# Altium project BBConverter.PrjPcb
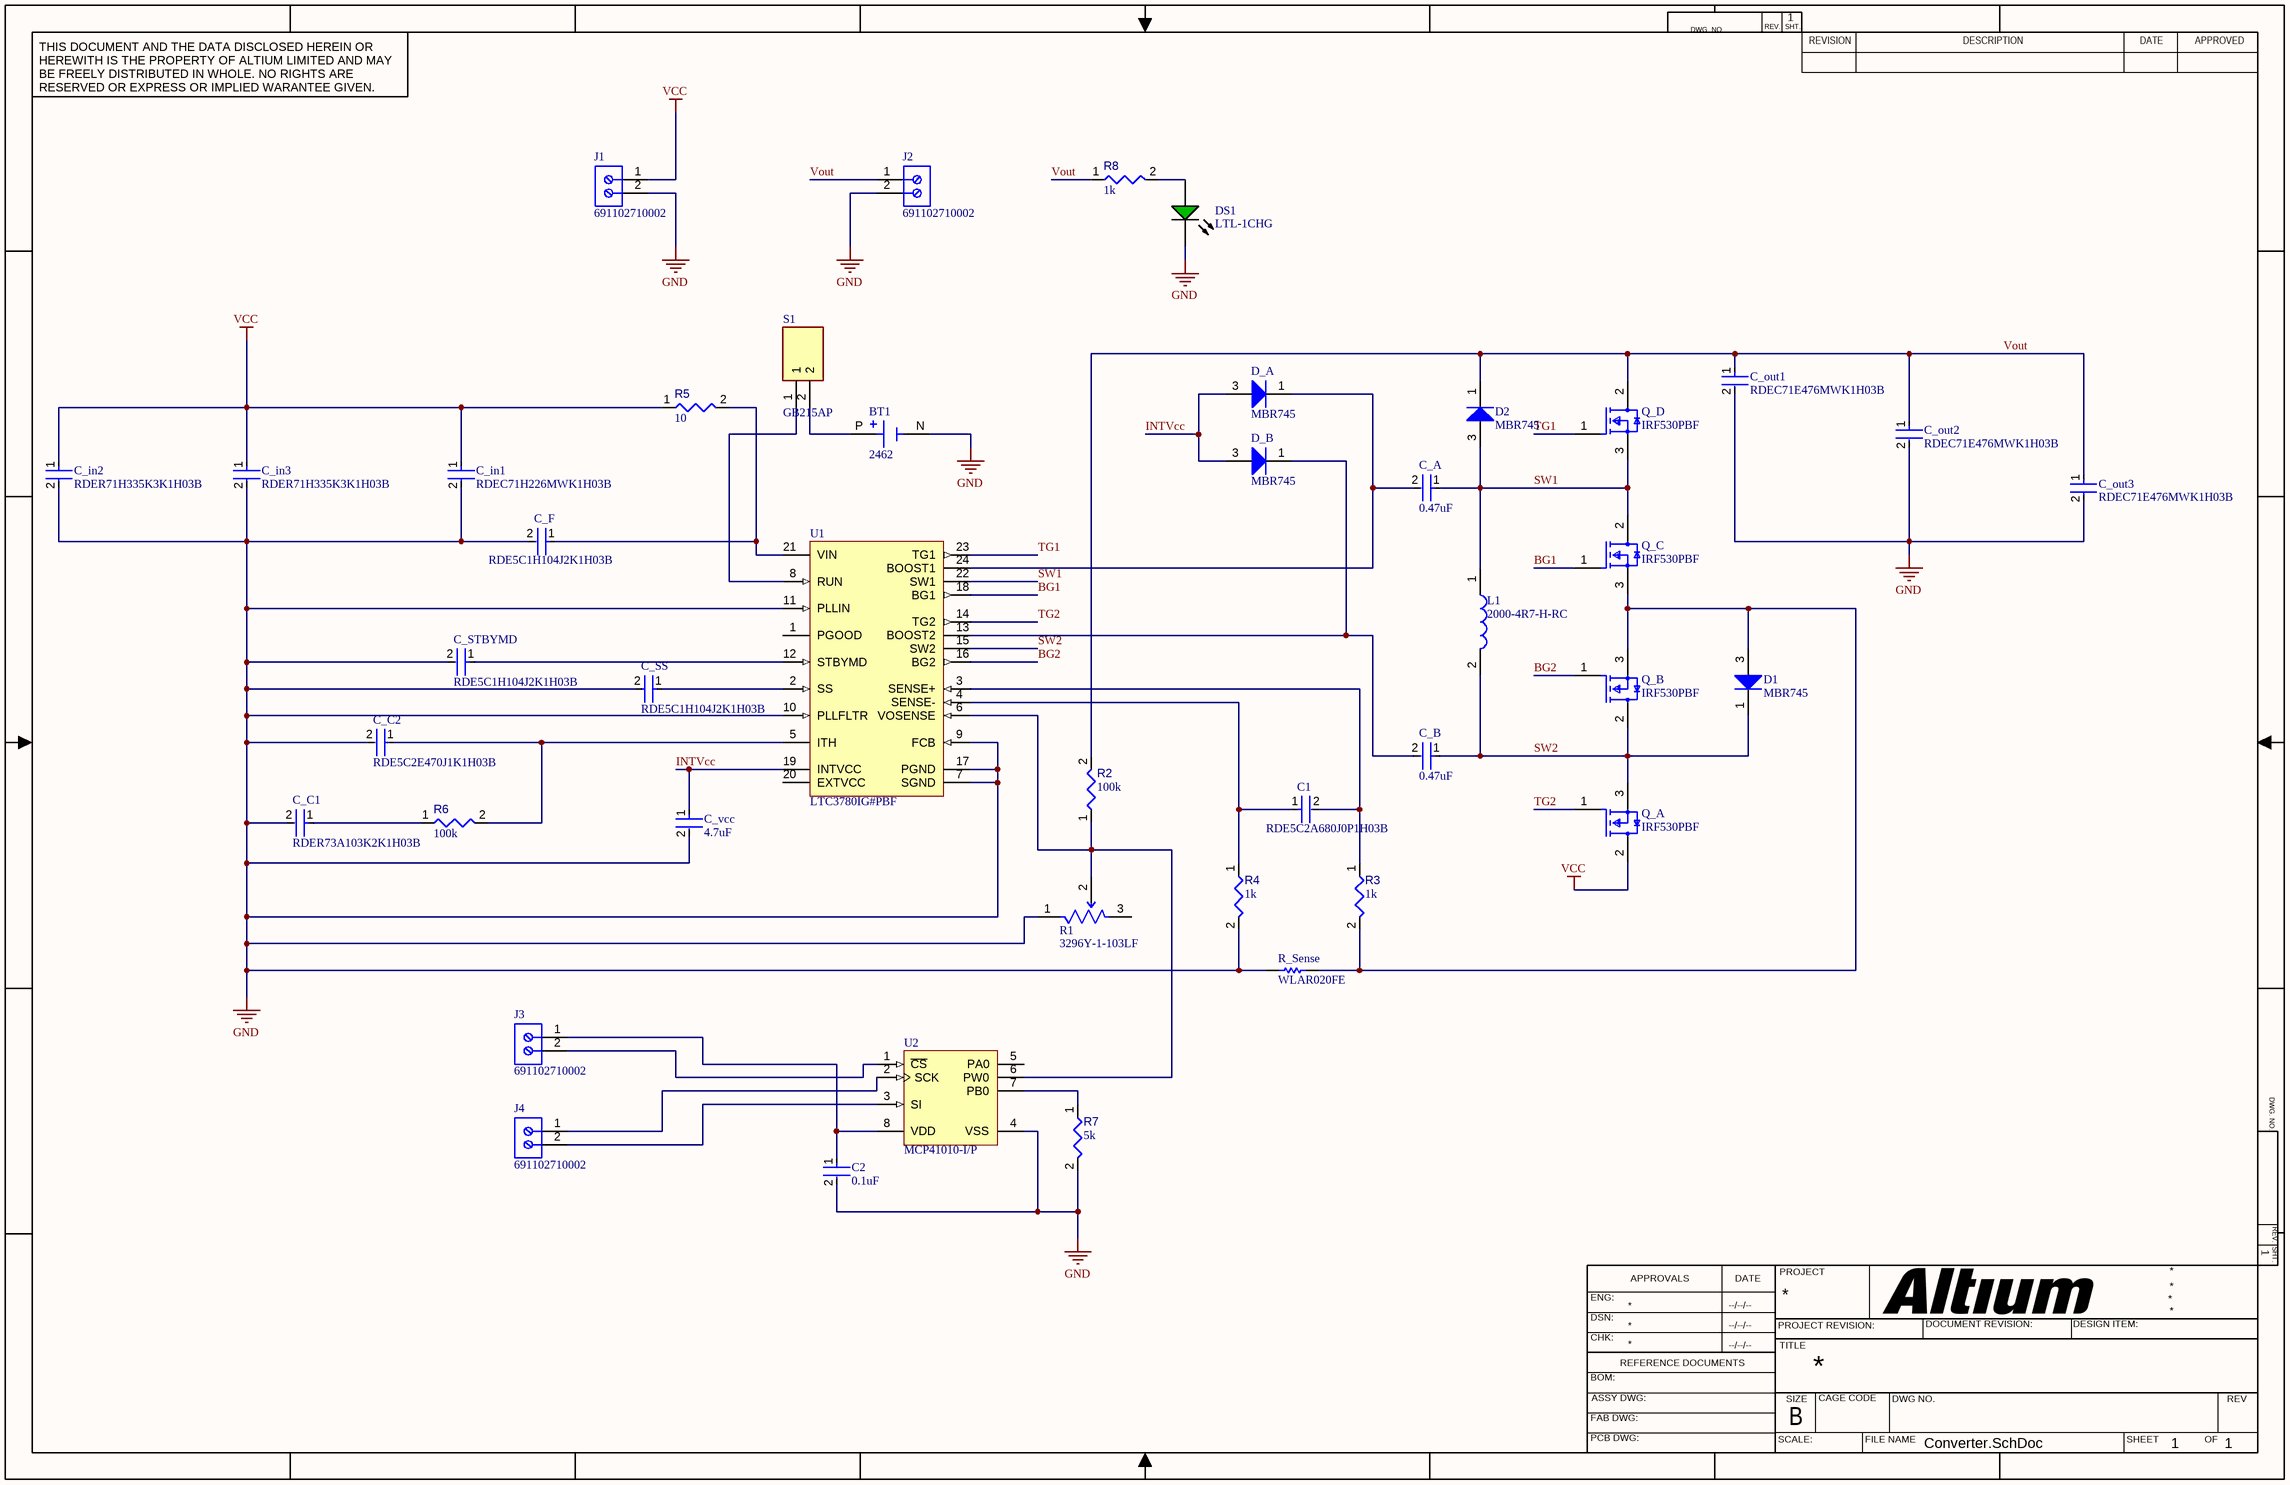
[diagram p0:  Converter.SchDoc]
 CAGE_CODE: ?????;  CONTRACT_NUMBER: <CONTRACT NO>;  DOC_NO_ASSY_DWG: <ASSY DWG NO>;  DOC_NO_BOM: <BOM DOC NO>;  DOC_NO_FAB_DWG: <FAB DWG NO>;  DOC_NO_SCH_DWG: <SCH DWG NO>;  PCB_2_DEC_TOL: +/-.01;  PCB_3_DEC_TOL: +/-.010;  PCB_ANG_TOL: +/-1/2;  PCB_ASSEMBLY_NO: <PCB ASSY NO>;  PCB_CHECKER: - -----;  PCB_CHECKER_APP_DATE: --/--/----;  PCB_DESIGNER: - -----;  PCB_DESIGNER_APP_DATE: --/--/----;  PCB_DWG_NO: <PCB DWG NO>;  PCB_ENGINEER: - -----;  PCB_ENGINEER_APP_DATE: --/--/----;  PCB_PART_NUMBER: <PCB PN>;  PCB_REV: A;  SCH_REV: A
1 sheet, 43 parts. Net scope: global (net labels, ports and power ports of the same name join across sheets).
Board file:  Converter.PcbDoc

## Sheet  Converter.SchDoc
size 431 x 279 mm; SheetNumber: 1; SheetTotal: 1; ENG_APP_DATE: --/--/--; DSN_APP_DATE: --/--/--; CHK_APP_DATE: --/--/--

### Parts
BT1  2462  [BAT_2462]
C1  RDE5C2A680J0P1H03B  [FP-RDE0P1-MFG]
C2  0.1uF  [FP-RDE2M1-MFG]
C_A  0.47uF  [FP-RCE1A2-MFG]
C_B  0.47uF  [FP-RCE1A2-MFG]
C_C1  RDER73A103K2K1H03B  [FP-RDE2M1-MFG]
C_C2  RDE5C2E470J1K1H03B  [FP-RDE1K1-MFG]
C_F  RDE5C1H104J2K1H03B  [FP-RDE2M1-MFG]
C_in1  RDEC71H226MWK1H03B  [FP-RDEWK1-MFG]
C_in2  RDER71H335K3K1H03B  [FP-RDE3M1-MFG]
C_in3  RDER71H335K3K1H03B  [FP-RDE3M1-MFG]
C_out1  RDEC71E476MWK1H03B  [FP-RDEWK1-MFG]
C_out2  RDEC71E476MWK1H03B  [FP-RDEWK1-MFG]
C_out3  RDEC71E476MWK1H03B  [FP-RDEWK1-MFG]
C_SS  RDE5C1H104J2K1H03B  [FP-RDE2M1-MFG]
C_STBYMD  RDE5C1H104J2K1H03B  [FP-RDE2M1-MFG]
C_vcc  4.7uF  [FP-RDE2M1-MFG]
D1  MBR745  [ONSC-TO-220-2-221B-04_E]
D2  MBR745  [ONSC-TO-220-2-221B-04_E]
D_A  MBR745  [ONSC-TO-220-2-221B-04_E]
D_B  MBR745  [ONSC-TO-220-2-221B-04_E]
DS1  LTL-1CHG  [LTST-LTL-1CHG-2]
J1  691102710002  [691102710002]
J2  691102710002  [691102710002]
J3  691102710002  [691102710002]
J4  691102710002  [691102710002]
L1  2000-4R7-H-RC  [20004R7HRC]
Q_A  IRF530PBF  [FP-X15-0364-MFG]
Q_B  IRF530PBF  [FP-X15-0364-MFG]
Q_C  IRF530PBF  [FP-X15-0364-MFG]
Q_D  IRF530PBF  [FP-X15-0364-MFG]
R1  3296Y-1-103LF  [FP-3296Y-MFG]
R2  value 100k  [RESA60-630X240]  (hidden comment: MFR-25FBF52-1K)
R3  value 1k  [RESA60-630X240]  (hidden comment: MFR-25FBF52-1K)
R4  value 1k  [RESA60-630X240]  (hidden comment: MFR-25FBF52-1K)
R5  value 10  [RESA60-630X240]  (hidden comment: MFR-25FBF52-1K)
R6  value 100k  [RESA60-630X240]  (hidden comment: MFR-25FBF52-1K)
R7  value 5k  [RESA60-630X240]  (hidden comment: MFR-25FBF52-1K)
R8  value 1k  [RESA60-630X240]  (hidden comment: MFR-25FBF52-1K)
R_Sense  WLAR020FE  [OMTE-WLA-2_V2]
S1  GB215AP  [GB215AP]
U1  LTC3780IG#PBF  [LT-G-24_M]
U2  MCP41010-I/P  [PDIP300-P8]

### Nets
GND: BT1.N(NEG) C2.2 C_C1.2 C_C2.2 C_F.2 C_in1.2 C_in2.2 C_in3.2 C_out1.2 C_out2.2 C_out3.2 C_SS.2 C_STBYMD.2 C_vcc.2 DS1.2(K) J1.2 J2.2 R1.1(CCW) R4.2 R7.2 R_Sense.1 U1.7(SGND) U1.9(FCB) U1.10(PLLFLTR) U1.11(PLLIN) U1.17(PGND) U2.4(VSS)
VCC: C_in1.1 C_in2.1 C_in3.1 J1.1 Q_A.2(D) R5.1
BG1: Q_C.1(G) U1.18(BG1)
BG2: Q_B.1(G) U1.16(BG2)
INTVcc: C_vcc.1 D_A.3(A) D_B.3(A) U1.19(INTVCC)
SW1: C_A.1 D2.3(A) L1.1 Q_C.2(D) Q_D.3(S) U1.22(SW1)
SW2: C_B.1 D1.1(K) L1.2 Q_A.3(S) Q_B.2(D) U1.15(SW2)
TG1: Q_D.1(G) U1.23(TG1)
TG2: Q_A.1(G) U1.14(TG2)
Vout: C_out1.1 C_out2.1 C_out3.1 D2.1(K) J2.1 Q_D.2(D) R2.2 R8.1
NetBT1_P: BT1.P(POS) S1.2
NetC1_1: C1.1 R4.1 U1.4(SENSE-)
NetC1_2: C1.2 R3.1 U1.3(SENSE+)
NetC2_1: C2.1 J3.1 U2.8(VDD)
NetC_A_2: C_A.2 D_A.1(K) U1.24(BOOST1)
NetC_B_2: C_B.2 D_B.1(K) U1.13(BOOST2)
NetC_C1_1: C_C1.1 R6.1
NetC_C2_1: C_C2.1 R6.2 U1.5(ITH)
NetC_F_1: C_F.1 R5.2 U1.21(VIN)
NetC_SS_1: C_SS.1 U1.2(SS)
NetC_STBYMD_1: C_STBYMD.1 U1.12(STBYMD)
NetD1_3: D1.3(A) Q_B.3(S) Q_C.3(S) R3.2 R_Sense.2
NetDS1_1: DS1.1(A) R8.2
NetJ3_2: J3.2 U2.1(~{CS})
NetJ4_1: J4.1 U2.2(SCK)
NetJ4_2: J4.2 U2.3(SI)
NetR1_2: R1.2(WIPER) R2.1 U1.6(VOSENSE) U2.6(PW0)
NetR7_1: R7.1 U2.7(PB0)
NetS1_1: S1.1 U1.8(RUN)

Not connected (* = marked no-connect by the designer): R1 3(CW); U1 1(PGOOD) 20(EXTVCC); U2 5(PA0)

### Notes on the sheet
- DWG. NO.
- REV.
- SHT.
- THIS DOCUMENT AND THE DATA DISCLOSED HEREIN OR HEREWITH IS THE PROPERTY OF ALTIUM LIMITED AND MAY BE FREELY DISTRIBUTED IN WHOLE. NO RIGHTS ARE RESERVED OR EXPRESS OR IMPLIED WARANTEE GIVEN.
- REVISION
- DESCRIPTION
- DATE
- APPROVED
- ENG:
- APPROVALS
- PROJECT
- DSN:
- CHK:
- REFERENCE DOCUMENTS
- PROJECT REVISION:
- TITLE
- DOCUMENT REVISION:
- DESIGN ITEM:
- BOM:
- FAB DWG:
- PCB DWG:
- ASSY DWG:
- SCALE:
- SIZE
- B
- CAGE CODE
- FILE NAME
- DWG NO.
- SHEET
- OF
- REV

### Library data of the parts
BT1 = 2462: Battery Holder (Open) AA 2 Cell PC Pin; MF: {'manufacturer': u'Keystone'}; MP: 2462; Availability: Unavailable; Package: None; Value: *; Price: None
C1 = CMP-06035-029057-1: Ceramic Capacitor 68pF ±5% 100V C0G Radial; Lead Diameter: 0.5mm; Dielectric: C0G; Width: 3.5mm; Min Operating Temperature: -55°C; Length: 0.197inch; Case/Package: Radial; Voltage Rating (DC): 100V; Packaging: Bulk; Package Quantity: 500; Lead Pitch: 0.098inch; Max Operating Temperature: 125°C; Height: 3.5mm; Capacitance: 68pF; Tolerance: 5%; Resistor Type: Ceramic; Voltage Rating: 100V; Height - Seated (Max): 0.236inch; Mount: Through Hole; Termination: Radial
C2 C_vcc = CMP-06035-049833-1: Ceramic Capacitor 4.7uF ±10% 50V X7S Radial; Lead Diameter: 0.5mm; Lead/Base Style: Kinked; Lead Pitch: 0.197inch; Height - Seated (Max): 0.236inch; Dielectric: X7S; Case/Package: Radial; Voltage Rating: 50V; Min Operating Temperature: -55°C; Voltage Rating (DC): 50V; Max Operating Temperature: 125°C; Length: 0.217inch; Capacitance: 4.7uF; Tolerance: 10%; Package Quantity: 1500; Packaging: Tape and Reel; Width: 0.124inch; Termination: Radial; Resistor Type: Ceramic; Mount: Through Hole; Height: 4mm
C_A C_B = CMP-06035-009921-1: Cap Ceramic 470nF 50V X7R ±10% Radial 2.5mm +125°C Automotive Bulk; Lead Diameter: 0.5mm; Lead/Base Style: Straight; Length: 0.157inch; Tolerance: 10%; Ratings: AEC-Q200; Case/Package: Radial; Termination: Radial; Resistor Type: Ceramic; Lead Pitch: 0.098inch; Min Operating Temperature: -55°C; Voltage Rating (DC): 50V; Width: 0.098inch; Height - Seated (Max): 0.138inch; Height: 3.5mm; Voltage Rating: 50V; Capacitance: 470nF; Packaging: Bulk; Mount: Through Hole; Max Operating Temperature: 125°C; Dielectric: X7R; Package Quantity: 500
C_C1 = CMP-06035-036813-1: Ceramic Capacitor 10nF ±10% 1kV X7R Radial; Lead/Base Style: Formed Leads; Capacitance: 10nF; Mount: Through Hole; Packaging: Bulk; Max Operating Temperature: 125°C; Tolerance: 10%; Voltage Rating: 1kV; Min Operating Temperature: -55°C; Case/Package: Radial
C_C2 = CMP-06035-055819-1: Ceramic Capacitor 47pF ±5% 250V C0G Radial
C_F C_SS C_STBYMD = CMP-06035-058915-1: Ceramic Capacitor 100nF ±5% 50V C0G Radial
C_in1 = CMP-06035-003638-1: CAP CER 22UF 50V X7S RADIAL; Lead/Base Style: Formed Leads; Tolerance: 20%; Mount: Through Hole; Max Operating Temperature: 125°C; Capacitance: 22uF; Packaging: Bulk; Voltage Rating: 50V; Min Operating Temperature: -55°C; Case/Package: Radial
C_in2 C_in3 = CMP-06035-014114-1: Ceramic Capacitor 3.3uF ±10% 50V X7R Radial; Lead/Base Style: Kinked; Lead Diameter: 0.5mm; Dielectric: X7R; Capacitance: 3.3uF; Lead Free: Lead Free; Voltage Rating: 50V; Packaging: Bulk; Termination: Radial; Resistor Type: Ceramic; Height: 5mm; Min Operating Temperature: -55°C; Length: 0.217inch; Tolerance: 10%; Case/Package: Radial; Max Operating Temperature: 125°C; Width: 0.157inch; Voltage Rating (DC): 50V; Height - Seated (Max): 0.295inch; Package Quantity: 500; Mount: Through Hole; Lead Pitch: 0.197inch
C_out1-C_out3 = CMP-06035-015598-1: Ceramic Capacitor 47uF ±20% 25V X7S Radial; Lead/Base Style: Formed Leads; Lead Diameter: 0.5mm; Mount: Through Hole; Lead Pitch: 0.197inch; Packaging: Bulk; Max Operating Temperature: 125°C; Package Quantity: 500; Lead Free: Lead Free; Length: 0.217inch; Termination: Radial; Tolerance: 20%; Capacitance: 47uF; Voltage Rating (DC): 25V; Width: 0.157inch; Voltage Rating: 25V; Resistor Type: Ceramic; Dielectric: X7S; Height - Seated (Max): 0.394inch; Case/Package: Radial; Min Operating Temperature: -55°C; Height: 7.5mm
D1 D2 D_A D_B = CMP-1055-00594-1: SWITCHMODE(TM) Power Rectifier, 2-Pin TO-220, Tube; Manufacturer: On Semiconductor; IFSM Max (A): 150; Configuration: Single; Mounting Technology: Through Hole; PackageVersion: Rev. E; ComponentLink3URL: http://www.onsemi.com/pub_link/Collateral/BYW29-D.PDF; PackageDescription: 2-Pin Flange Mount, Vertical Straight Lead, Body 9.97 x 4.44 mm, Pitch 5.08 mm; Packing: Tube; ComponentLink3Description: Package Specification; ComponentLink2Description: Datasheet; ComponentLink1URL: http://www.onsemi.com/; ComponentLink2URL: http://www.onsemi.cn/pub_link/Collateral/MBR735-D.PDF; RoHS: FALSE; ComponentLink1Description: Manufacturer URL; PackageReference: TO-220-2-221B-04_E; DatasheetVersion: Rev. 8; PartNumber: MBR745
DS1 = CMP-007-00019-2: LED Uni-Color Green, 100 mW, 30 mA, -55 to 100 degC, 2-Pin THD, RoHS, Bulk; Manufacturer: Lite-On; Power: 100mW; Forward Voltage: 2.6V; Forward Current: 30mA; Nominal Vf: 2.1V; Lens Style: Dome; Viewing Angle: 60degrees; Luminous Intensity: 12.6mcd; Max Operating Temperature: 100°C; Case/Package: Radial; Package Reference: LTL-1CHG; Manufacturer URL: http://www.us.liteon.com/; Package Quantity: 1000; Colour: Green; Packaging: Bulk; RoHS Compliant: True; Datasheet URL: http://datasheet.octopart.com/LTL-1CHG-Lite-On-datasheet-143841.pdf; Package Description: 2-Pin Through Hole Device, Dia 3.8 mm; Min Operating Temperature: -55°C; Mounting Technology: TH; Pins: 2; Illumination Colour: Green; Datasheet Version: Mar-00
J1-J4 = CMP-1502-03258-1: Series 102 - 5.00 mm Horizontal Entry Modular with Pressure Clamp WR-TBL, 2 pin; Manufacturer: Wurth Elektronik; Pin Number: 2; Pitch: 5.00mm; Manufacturer URL: http://www.we-online.de; Mounting Technology: THT; Publisher: WurthElektronik; Packaging: Box; Package Reference: 691102710002; Datasheet URL: http://katalog.we-online.de/em/datasheet/6911027100xx.pdf; Operating Temperature: -40to105degC; Part Number: 691102710002
L1 = 2000-4R7-H-RC: Inductor; Manufacturer_Name: Bourns; Datasheet Link: https://componentsearchengine.com/Datasheets/1/2000-4R7-H-RC.pdf; Height: 10.414mm; Manufacturer_Part_Number: 2000-4R7-H-RC
Q_A Q_B Q_C Q_D = CMP-02550-000190-1: MOSFET N-CH 100V 14A TO-220AB; Manufacturer: Vishay; Reverse Recovery Charge: 850nC; Rthja Max: 62°C/W; Power Dissipation: 88W; Depletion Mode: False; Input Capacitace At Vds: 670pF @ 25V; Pulse Drain Current: 56A; Turn On Delay Time: 10ns; Drain To Source Resistance: 0.16Ω; Number Of N Channels: 1; Max Junction Temp: +175°C; Threshold Vgs Max: 4V; Standoff Height: 3.33mm; Max Forward Diode Voltage: 2.5V; Turn Off Delay Time: 23ns; Gate To Source Voltage: 20V; Threshold Vgs Min: 2V; Reverse Recovery Time: 150ns; Gate Charge At Vgs: 26nC @ 10V; Temperature: -55°C to +175°C; Drain To Source Voltage: 100V; Mouser Description: MOSFET N-Chan 100V 14 Amp; Device Class L2: Transistors; Temperature Range High: +175°C; ComponentLink2URL: http://www.vishay.com/docs/91019/91019.pdf; Lead Free: Yes; Height: 19.89mm; Octopart: https://octopart.com/irf530pbf-vishay-46547999; Category: Trans; ComponentLink2Description: Datasheet; RoHS: TRUE; Device Class L3: MOSFETs; Automotive: No; Device Class L1: Discrete Semiconductors; Package: X15-0364; Manufacturer Part Number: IRF530PBF; Continuous Drain Current: 14A; Digikey Description: MOSFET N-CH 100V 14A TO-220AB; Number Of Channels: 1; Drain To Source Breakdown Voltage: 100V; Temperature Range Low: -55°C
R1 = CMP-07234-000015-2: TRIMMER 10K OHM 0.5W PC PIN TOP; Manufacturer Series: 3296; Resistance: 10kR; Actuator Orientation: Vertical; Power Rating: 500mW; Temperature Coefficient: 100ppm/°C; Resistance Tolerance: 10%; Resistance Law: Linear; Number of Turns: 25; Actuator Type: SCREW; Number of Terminals/Pins: 3; Insulation Resistance: 1GR; Military Standard: Not; REACH SVHC: No SVHC; Lead Free: Lead Free; Resistor Type: Cermet; Max Operating Temperature: 125°C; Radiation Hardening: No; Package Quantity: 50; Mount: Panel; Max Power Dissipation: 500mW; Min Operating Temperature: -55°C; Type: Potentiometer; Terminal Finish: Tin; Termination: Pin; Taper: Linear; Color: Blue; Technology: CERMET; Packaging: Rail/Tube; Weight: 0.03oz; Height: 0.395inch; Number of Pins: 3; RoHS Compliant: Yes; Width: 9.53mm; Tolerance: 10%; Depth: 4.83mm; Series: 3296; Length: 9.53mm
R2-R8 = CMP-009-00048-4: Axial Resistor, 1 KOhm, +/- 1%, 250 mW, -55 to 155 degC, 2-Pin THD, RoHS, Bulk; Manufacturer: Yageo; Voltage Rating: 250V; Power: 250mW; Min Operating Temperature: -55°C; Max Operating Temperature: 155°C; Tolerance: 1%; Package Reference: MFR-25; Composition: CarbonFilm; Mounting Technology: TH; Packaging: Bulk; Case/Package: Axial; Datasheet URL: http://www.yageo.com/documents/recent/Yageo%20LR_MFR_2013.pdf; Package Quantity: 200; Manufacturer URL: http://www.yageo.com/; Package Description: 2-Pin Axial Lead, Dia 2.4 mm, Body Length 6.3 mm; Datasheet Version: Apr-13; RoHS Compliant: True
R_Sense = CMP-1237-00001-1: Miniature Wirewound Current Sense, 0.02 Ohm +/-1%, 0.5 W, 2-Pin THD, RoHS, 25pc Pack; Manufacturer: Ohmite; Power Rating: 0.5 W; ComponentLink1URL: http://www.ohmite.com/; ComponentLink3URL: http://www.ohmite.com/cat/res_wl.pdf; DatasheetVersion: May-14; Rated Resistance: 0.02 Ohm; Resistance Tolerance: +/-1%; PackageDescription: 2-Pin Axial Lead, Body 5.08 x 2.54 mm, Lead Spread 25 mm; ComponentLink3Description: Package Specification; RoHS: TRUE; PartNumber: WLAR020FE; ComponentLink2URL: http://www.ohmite.com/cat/res_wl.pdf; Mounting Technology: Through Hole; Packing: 25pc Pack; ComponentLink2Description: Datasheet; ComponentLink1Description: Manufacturer URL
S1 = GB215AP: Switch; Manufacturer_Name: NKK Switches; Datasheet Link: https://www.nkkswitches.com/pdf/GB2Pushbuttons.pdf; Height: 10mm; Manufacturer_Part_Number: GB215AP
U1 = CMP-0492-00697-1: Buck-boost Controller, Constant Frequency, Current Mode Control with Power Good Output, 24-pin SOP (G-24), -40 to 125 degC, Pb-Free; Manufacturer: Linear Technology; Frequency Sync Range: 200kHz - 400kHz; Number of Outputs: 1; PackageDescription: 24-Pin Plastic SSOP, Body 8.2 x 5.3 mm, Pitch 0.65 mm; ComponentLink3Description: Package Specification; PackageVersion: Jun-10; ComponentLink3URL: http://cds.linear.com/docs/en/packaging/SSOP_24_05-08-1640.pdf; ComponentLink1URL: http://www.linear.com/; ComponentLink1Description: Manufacturer URL; RoHS: TRUE; PartNumber: LTC3780IG#PBF; ComponentLink2URL: http://cds.linear.com/docs/en/datasheet/3780ff.pdf; PackageReference: G-24; ComponentLink2Description: Datasheet; Mounting Technology: Surface Mount; DatasheetVersion: Rev. F
U2 = CMP-0188-00249-2: Single/Dual Digital Potentiometer with SPI Interface, 8-Pin PDIP, Industrial Temperature; DatasheetVersion: Jul-2003; Code_JEDEC: MS-001; ComponentLink1Description: Manufacturer URL; RevisionNote: URLs added.; ComponentLink2Description: Datasheet; PackageDescription: 8-Lead Plastic Dual In-Line (P) - 300 mil Body [PDIP]; ComponentLink2URL: http://ww1.microchip.com/downloads/en/DeviceDoc/11195c.pdf; PackageVersion: revBB, Aug-2009; PackageReference: PDIP300-P8; ComponentLink3Description: Package Specification; ComponentLink3URL: http://www.microchip.com/stellent/groups/techpub_sg/documents/packagingspec/en012702.pdf; ComponentLink1URL: http://www.microchip.com/